# Altium schematic sheet type-c.SchDoc
size A4; SheetNumber: 3; SheetTotal: 5
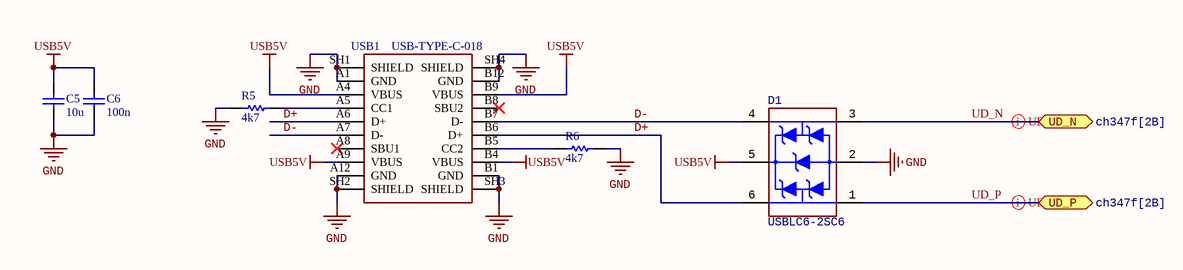
[diagram p0: type-c.SchDoc]

## Parts
C5  value 10u  [CAPC160X80X90L30N]  (hidden comment: Capacitor)
C6  value 100n  [CAPC100X50X55L25N]  (hidden comment: Capacitor)
D1  USBLC6-2SC6  [fp-0018]
R5  value 4k7  [RESC100X50X35L25N]  (hidden comment: Resistor)
R6  value 4k7  [RESC100X50X35L25N]  (hidden comment: Resistor)
USB1  USB-TYPE-C-018  [USB-TYPE-C-018]

## Ports
UD_N (bidir, see ch347f[2B]), UD_P (bidir, see ch347f[2B])

## Nets
GND: C5.1 C6.1 D1.2 R5.2 R6.1 USB1.A1(GND) USB1.A12(GND) USB1.B1(GND) USB1.B12(GND) USB1.SH1(SHIELD) USB1.SH2(SHIELD) USB1.SH3(SHIELD) USB1.SH4(SHIELD)
USB5V: C5.2 C6.2 D1.5 USB1.A4(VBUS) USB1.A9(VBUS) USB1.B4(VBUS) USB1.B9(VBUS)
D+: D1.6 USB1.A6(D+) USB1.B6(D+)
D-: D1.4 USB1.A7(D-) USB1.B7(D-)
UD_N: D1.3 ; port UD_N
UD_P: D1.1 ; port UD_P
NetR5_1: R5.1 USB1.A5(CC1)
NetR6_2: R6.2 USB1.B5(CC2)

Not connected (* = marked no-connect by the designer): USB1 A8(SBU1)* B8(SBU2)*

## Layout directives
differential pair: UD_N, UD_P

## Library data of the parts
C5 = GRM188R61E106KA73D: MPN: TCC0603X5R106K100CT; Manufacturer: CCTC(三环); 编号: C380314; Case/Package: 0603; Mounting Type: SMD
C6 = GRM188R61E106KA73D: MPN: TCC0402X5R104M250AT; Manufacturer: CCTC(三环); 编号: C359190; Case/Package: 0402; Mounting Type: SMD
D1 = CMP-0000065: 15V 6V SOT-23-6 Electrostatic and Surge Protection (TVS/ESD) ROHS; Manufacturer: UMW; CPN: 000000; ID: CMP-0000065; MPN: USBLC6-2SC6; Category: TVS/ESD; ComponentLink1Description: Product Link; ComponentLink1URL: https://www.lcsc.com/product-detail/Electrostatic-and-Surge-Protection-TVS-ESD_UMW-Youtai-Semiconductor-Co-Ltd-USBLC6-2SC6_C2687116.html; ComponentLink2Description: Datasheet Link; ComponentLink2URL: https://datasheet.lcsc.com/lcsc/2311091738_UMW-Youtai-Semiconductor-Co---Ltd--USBLC6-2SC6_C2687116.pdf; LCSC PN: C2687116
R5 R6 = RC0402FR-07100KL: MPN: RTT02472JTH; Manufacturer: RALEC(旺诠); 编号: C103059; Case/Package: 0402; Mounting Type: SMD
USB1 = USB-TYPE-C-018: 编号: C2927038